# Altium project Controller.PrjPcb
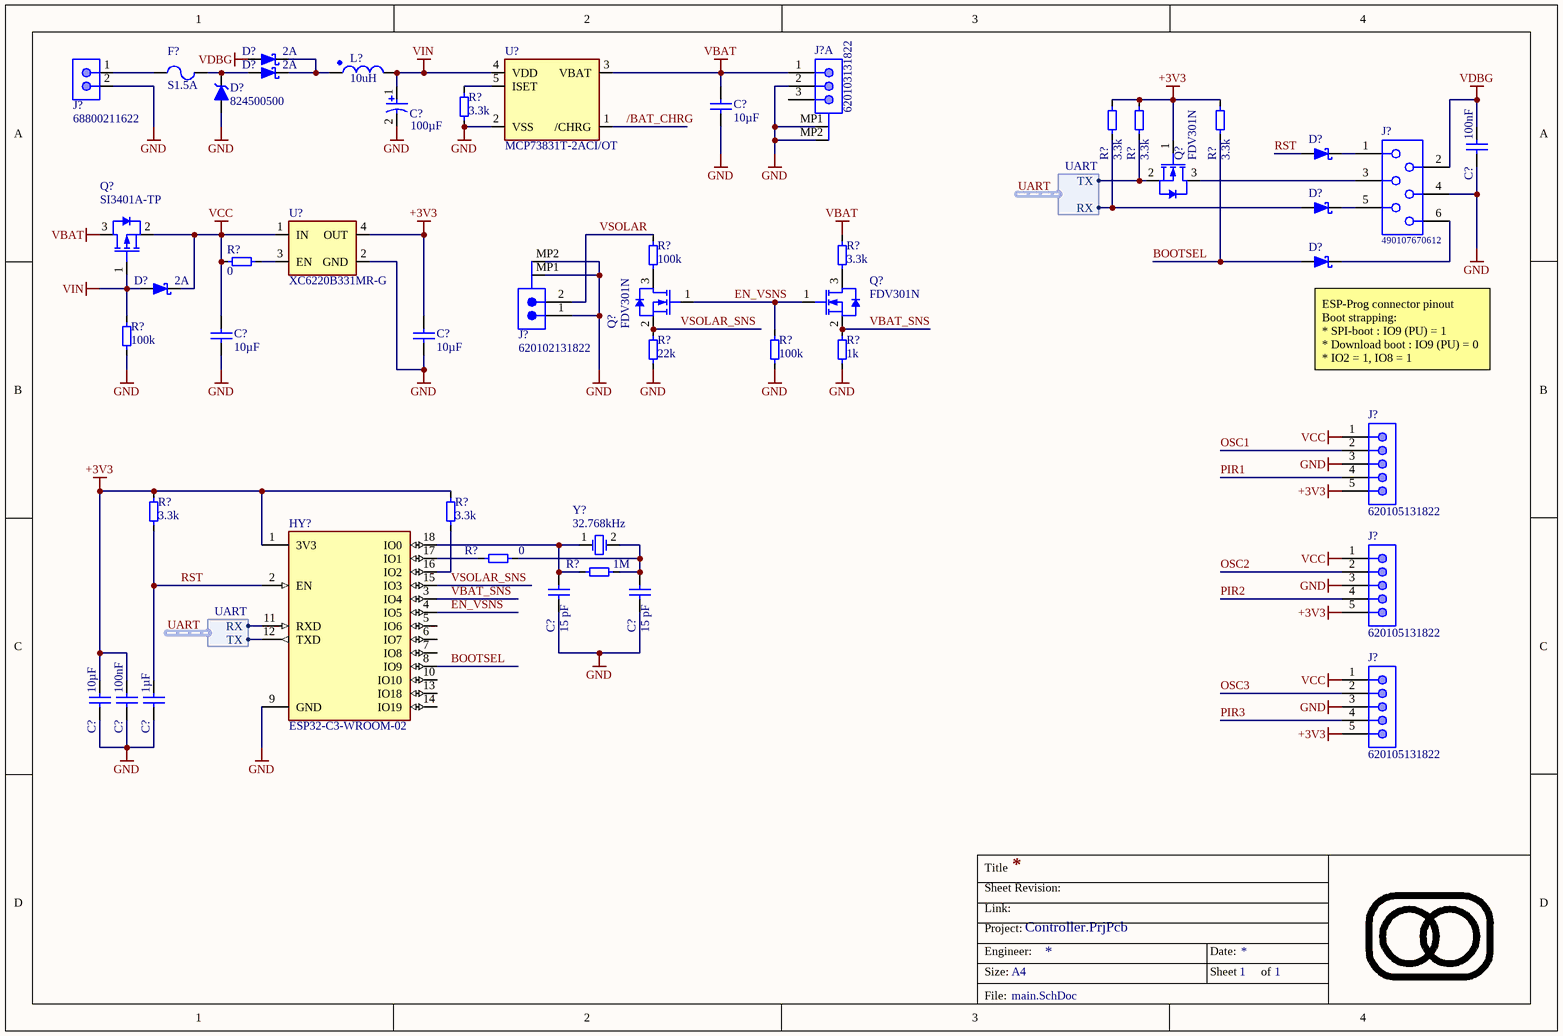
[diagram p0: main.SchDoc]
assembly_revision: 0; board_name: BRD123456; board_revision: 1.0
1 sheet, 50 parts. Net scope: global (net labels, ports and power ports of the same name join across sheets).
Board file: PCB.PcbDoc

## Sheet main.SchDoc
size A4; SheetNumber: 1; SheetTotal: 1

### Parts
(Parts that share a designator on the sheet are numbered #1, #2 ... from top to bottom, then left to right.)
C?#1  Capacitance: 100µF  [CA_POL_D5_H5.5]  (hidden comment: 875105242010)
C?#2  value 10µF  [0805-C-L]  (hidden comment: Capacitor 10µF +/-10% 10V X7R 0805)
C?#3  value 100nF  [0603-C-L]  (hidden comment: Capacitor 100nF +/-10% 25V X7R 0603)
C?#4  value 10µF  [0805-C-L]  (hidden comment: Capacitor 10µF +/-10% 10V X7R 0805)
C?#5  value 10µF  [0805-C-L]  (hidden comment: Capacitor 10µF +/-10% 10V X7R 0805)
C?#6  value 15 pF  [0603-C-N]  (hidden comment: Capacitor 15 pF +/-5% 50V C0G 0603)
C?#7  value 15 pF  [0603-C-N]  (hidden comment: Capacitor 15 pF +/-5% 50V C0G 0603)
C?#8  value 10µF  [0805-C-L]  (hidden comment: Capacitor 10µF +/-10% 10V X7R 0805)
C?#9  value 100nF  [0603-C-L]  (hidden comment: Capacitor 100nF +/-10% 25V X7R 0603)
C?#10  value 1µF  [0603-C-N]  (hidden comment: Capacitor 1µF +/-10% 16V X7R 0603)
D?#1  Average Rectified Current: 2A  [FP-SOD123W-MFG]  (hidden comment: PMEG10020ELRX)
D?#2  Average Rectified Current: 2A  [FP-SOD123W-MFG]  (hidden comment: PMEG10020ELRX)
D?#3  824500500  [DO-214AC_UNI]
D?#4  1PS79SB30,115  [FP-SOD523-MFG]  (value not drawn)
D?#5  1PS79SB30,115  [FP-SOD523-MFG]  (value not drawn)
D?#6  1PS79SB30,115  [FP-SOD523-MFG]  (value not drawn)
D?#7  Average Rectified Current: 2A  [FP-SOD123W-MFG]  (hidden comment: PMEG10020ELRX)
F?  value S1.5A  [1206-R-N]  (hidden comment: SF-1206S150-2)
HY?  ESP32-C3-WROOM-02  [ESP32­C3­WROOM­02]
J?#1  620103131822  [620103131822]  (part A of 2)
J?#2  68800211622  [68800211622]
J?#3  620103131822  [620103131822]  (value not drawn)  (part B of 2)
J?#4  490107670612  [490107670612_Debugging Application]  (no BOM)
J?#5  620102131822  [620102131822]
J?#6  620105131822  [620105131822]
J?#7  620105131822  [620105131822]
J?#8  620105131822  [620105131822]
L?  Inductance: 10uH  [WE-MAIA_4030]  (hidden comment: 78438357100)
Q?#1  FDV301N  [SOT-23-3-N]
Q?#2  SI3401A-TP  [SOT-23-3-N]
Q?#3  FDV301N  [SOT-23-3-N]
Q?#4  FDV301N  [SOT-23-3-N]
R?#1  value 3.3k  [0603-R-N]  (hidden comment: Resistor 3.3k +/-1% 50V 0603)
R?#2  value 3.3k  [0603-R-N]  (hidden comment: Resistor 3.3k +/-1% 50V 0603)
R?#3  value 3.3k  [0603-R-N]  (hidden comment: Resistor 3.3k +/-1% 50V 0603)
R?#4  value 3.3k  [0603-R-N]  (hidden comment: Resistor 3.3k +/-1% 50V 0603)
R?#5  value 100k  [0603-R-N]  (hidden comment: Resistor 100k +/-1% 50V 0603)
R?#6  value 3.3k  [0603-R-N]  (hidden comment: Resistor 3.3k +/-1% 50V 0603)
R?#7  value 0  [0603-R-N]  (hidden comment: Jumper 0R <50 mOhm 1A 0603)
R?#8  value 100k  [0603-R-N]  (hidden comment: Resistor 100k +/-1% 50V 0603)
R?#9  value 22k  [0603-R-N]  (hidden comment: Resistor 22k +/-1% 50V 0603)
R?#10  value 100k  [0603-R-N]  (hidden comment: Resistor 100k +/-1% 50V 0603)
R?#11  value 1k  [0603-R-N]  (hidden comment: Resistor 1k +/-1% 50V 0603)
R?#12  value 3.3k  [0603-R-N]  (hidden comment: Resistor 3.3k +/-1% 50V 0603)
R?#13  value 3.3k  [0603-R-N]  (hidden comment: Resistor 3.3k +/-1% 50V 0603)
R?#14  value 0  [0603-R-N]  (hidden comment: Jumper 0R <50 mOhm 1A 0603)
R?#15  value 1M  [0603-R-N]  (hidden comment: Resistor 1M +/-1% 50V 0603)
U?#1  MCP73831T-2ACI/OT  [SOT25-N]
U?#2  XC6220B331MR-G  [SOT25-N]
Y?  Frequency: 32.768kHz  [WE-XTAL_CFPX-217]  (hidden comment: 830009678)

### Harnesses
UART: RX, TX

### Nets
+3V3: C?#5.1 C?#8.2 C?#9.2 HY?.1(3V3) J?#6.5 J?#7.5 J?#8.5 Q?#1.1(G) R?#2.2 R?#3.2 R?#4.2 R?#12.2 R?#13.2 U?#2.4(OUT)
GND: C?#1.2 C?#2.2 C?#3.1 C?#4.2 C?#5.2 C?#6.1 C?#7.1 C?#8.1 C?#9.1 C?#10.1 D?#3.2(A) HY?.9(GND) J?#1.2 J?#2.2 J?#3.MP1 J?#3.MP2 J?#4.4 J?#5.1 J?#5.MP1 J?#5.MP2 J?#6.3 J?#7.3 J?#8.3 R?#1.2 R?#8.2 R?#9.1 R?#10.2 R?#11.1 U?#1.2(VSS) U?#2.2(GND)
VBAT: C?#2.1 J?#1.1 Q?#2.3(DRAIN) R?#6.1 U?#1.3(VBAT)
VCC: C?#4.1 D?#7.1(K) J?#6.1 J?#7.1 J?#8.1 Q?#2.2(SOURCE) R?#7.1 U?#2.1(IN)
VDBG: C?#3.2 D?#1.2(A) J?#4.2
VIN: C?#1.1 D?#7.2(A) L?.2 Q?#2.1(GATE) R?#8.1 U?#1.4(VDD)
/BAT_CHRG: U?#1.1(/CHRG)
BOOTSEL: D?#6.2(A) HY?.8(IO9) R?#4.1
EN_VSNS: HY?.4(IO5) Q?#3.1(G) Q?#4.1(G) R?#10.1
OSC1: J?#6.2
OSC2: J?#7.2
OSC3: J?#8.2
PIR1: J?#6.4
PIR2: J?#7.4
PIR3: J?#8.4
RST: C?#10.2 D?#4.2(A) HY?.2(EN) R?#12.1
UART.RX: D?#5.2(A) HY?.11(RXD) R?#2.1 ; harness UART.RX
UART.TX: HY?.12(TXD) Q?#1.2(S) R?#3.1 ; harness UART.TX
VBAT_SNS: HY?.3(IO4) Q?#4.2(S) R?#11.2
VSOLAR: J?#5.2 R?#5.1
VSOLAR_SNS: HY?.15(IO3) Q?#3.2(S) R?#9.2
NetC?#6_2: C?#6.2 HY?.18(IO0) R?#15.1 Y?.1(OSC1)
NetC?#7_2: C?#7.2 R?#14.2 R?#15.2 Y?.2(OSC2)
NetD?#1_1: D?#1.1(K) D?#2.1(K) L?.1
NetD?#2_2: D?#2.2(A) D?#3.1(K) F?.2
NetD?#4_1: D?#4.1(K) J?#4.1
NetD?#5_1: D?#5.1(K) J?#4.5
NetD?#6_1: D?#6.1(K) J?#4.6
NetF?_1: F?.1 J?#2.1
NetHY?_16: HY?.16(IO2) R?#13.1
NetHY?_17: HY?.17(IO1) R?#14.1
NetJ?#4_3: J?#4.3 Q?#1.3(D)
NetQ?#3_3: Q?#3.3(D) R?#5.2
NetQ?#4_3: Q?#4.3(D) R?#6.2
NetR?#1_1: R?#1.1 U?#1.5(ISET)
NetR?#7_2: R?#7.2 U?#2.3(EN)

Not connected (* = marked no-connect by the designer): HY? 5(IO6) 6(IO7) 7(IO8) 10(IO10) 13(IO18) 14(IO19); J?#1 3

### Notes on the sheet
- (near D?#6) ESP-Prog connector pinout
  Boot strapping:
  * SPI-boot : IO9 (PU) = 1
  * Download boot : IO9 (PU) = 0
  * IO2 = 1, IO8 = 1
- Title
- Sheet Revision:
- Link:
- Size:
- Project:
- Engineer:
- A4
- Date:
- Sheet
- of
- File:

### Library data of the parts
C?#1 = CMP-150-000020-2: WCAP-PSLP Aluminum Polymer Capacitor, V-Chip SMT, D5 x H5.5mm, 100µF, 10V; Manufacturer: Wurth Elektronik; ESR: 30mO; Dissipation Factor: 8%; Leakage Current: 300µA; Technical Reference: PSEC055101M010DVCTBB000; Ripple Current: 1970mA; Capacitance Tolerance: +/-20%; Endurance: 2000h; Mount: Surface Mount; ComponentLink2URL: https://www.we-online.com/redexpert/spec/875105242010?ad; Height: 5.5mm; Design Item ID: 875105242010; Diameter: 5mm; Manufacturer Part Number: 875105242010; Source: WCAP-PSLP.SchLib; Operating Temperature Min: -55°C; Pin Count: 2; Packaging: Tape and Reel; ComponentLink2Description: Datasheet Link; Component Type: Standard; Match Code: WCAP-PSLP; ComponentLink1Description: Website Link; Rated Voltage (DC): 10V; ComponentLink1URL: https://www.we-online.com/redexpert/article/875105242010?ad; Operating Temperature Max: 105°C; Category: Aluminum Polymer Capacitors
C?#2 C?#4 C?#5 C?#8 = CMP-072-000663-10: WCAP-CSGP Multilayer Ceramic Chip Capacitor, General Purpose, size 0805, X7R, 10µF, 10VDC; Technical Reference: X7R0805106K010DFCT10000; Tolerance: 10%; Capacitor Type: MLCC; Insulation Resistance: 0.01GO; Length: 2mm; ComponentLink2URL: https://www.we-online.com/redexpert/spec/885012207026?ad; Packaging: Tape and Reel; ComponentLink1Description: Website Link; Design Item ID: 885012207026; Source: WCAP-CSGP.SchLib; ComponentLink2Description: Datasheet Link; Pins: 2; Usage: General Purpose; Voltage Rating: 10V; Height: 1.25mm; ComponentLink1URL: https://www.we-online.com/redexpert/article/885012207026?ad; Dielectric: X7R; Mounting Technology: SMT; Dissipation Factor: 10%; Min Operating Temperature: -55°C; Width: 1.25mm; Max Operating Temperature: 125°C; Case/Package: 0805; Match Code: WCAP-CSGP; JLCPCB Part #: C15850
C?#3 C?#9 = CMP-072-000593-10: WCAP-CSGP Multilayer Ceramic Chip Capacitor, General Purpose, size 0603, X7R, 100nF, 25VDC; Capacitor Type: MLCC; Tolerance: 10%; Dissipation Factor: 3.5%; Technical Reference: X7R0603104K025DFCT20000; Insulation Resistance: 5GO; Length: 1.6mm; Dielectric: X7R; Height: 0.8mm; Pins: 2; Min Operating Temperature: -55°C; Usage: General Purpose; Mounting Technology: SMT; Case/Package: 0603; Width: 0.8mm; Max Operating Temperature: 125°C; Voltage Rating: 25V; Design Item ID: 885012206071R; ComponentLink1URL: https://www.we-online.com/redexpert/article/885012206071R?ad; ComponentLink2URL: https://www.we-online.com/redexpert/spec/885012206071R?ad; Packaging: Tape and Reel; ComponentLink1Description: Website Link; Match Code: WCAP-CSGP; ComponentLink2Description: Datasheet Link; Source: WCAP-CSGP.SchLib
C?#6 C?#7 = CMP-001-00107-9: Capacitor MLCC, General Purpose, size 0603, C0G, 15 pF, +/-5%, 50V; Tolerance: 5%; Min Operating Temperature: -55°C; RoHS Compliant: Yes; Dielectric: C0G; Width: 0.8mm; Voltage Rating: 50V; Pins: 2; Height: 0.8mm; Max Operating Temperature: 125°C; Usage: General Purpose; Case/Package: 0603; Mounting Technology: SMT; Capacitor Type: MLCC; Length: 1.6mm
C?#10 = CMP-001-00004-18: Capacitor MLCC, General Purpose, size 0603, X7R, 1µF, +/-10%, 16V; Tolerance: 10%; Usage: General Purpose; Mounting Technology: SMT; Width: 0.8mm; Voltage Rating: 16V; RoHS Compliant: True; Capacitor Type: MLCC; Case/Package: 0603; Min Operating Temperature: -55°C; Dielectric: X7R; Pins: 2; Max Operating Temperature: 125°C; Length: 1.6mm; Height: 0.8mm; JLCPCB Part #: C15849
D?#1 D?#2 D?#7 = CMP-004-00046-6: Diode Schottky 100V 2A 2-Pin SOD-123F T/R; Forward Voltage: 830 mV @ 2 A; RoHS Compliant: Yes; Max Reverse Voltage (DC): 100V; Series: -; JLCPCB Part #: C456130; Forward Current: 2A; Mounting Technology: Surface Mount; Packaging: Tape and Reel; Case/Package: SOD-123F
D?#3 = CMP-074-000038-8: WE-TVSP SMT Power TVS Diode, DO-214AC, 400W, 5VDC, Unidirectional; Manufacturer: Wurth Elektronik; Clamping Voltage: 9.2V; (Reverse) Peak Pulse Current: 43.5A; (Reverse) Breakdown Voltage: 6.7V; DC Operating Voltage: 5V; Pin Count: 2; Component Type: Standard; Published Date: July 2020; Source: WE-TVSP_DO-214AC_Unidirectional.SchLib; JLCPCB Part #: C2925443; Mounting Technology: SMT; ComponentLink1URL: http://www.we-online.de; Polarity: Unidirectional; Power Dissipation: 400W; ComponentLink2URL: https://www.we-online.com/catalog/datasheet/824500500.pdf; Design Item ID: 824500500; ComponentLink2Description: Datasheet; Operating Temperature: -65 to +150degC; Packaging: Tape and Reel; Manufacturer Part Number: 824500500; Size: DO-214AC; ComponentLink1Description: Manufacturer
D?#4-D?#6 = CMP-004-00048-8: VR=40V IF=200mA 20pF; Forward Voltage: 600 mV @ 200 mA; Forward Current: 200mA; Max Repetitive Reverse Voltage (Vrrm): 40V; Case/Package: SOD-523; JLCPCB Part #: C426690; RoHS Compliant: Yes
F? = CMP-005-00019-2: Fuse Chip Slow Blow Acting 1.5A 63V SMD Solder Pad 1206 T/R UL; Fuse Type: Board Mount (Cartridge Style Excluded); DC Cold Resistance: 51mR; Fuse Size: 3.1 X 1.55 X 0.6mm; Body Material: Ceramic; Length: 3.1mm; Voltage Rating: 63V; Pins: 2; JLCPCB Part #: C913209; Packaging: Tape and Reel; Reach SVHC Compliant: No; Max Operating Temperature: 105°C; Mounting Technology: Surface Mount; Housing Material: Ceramic; Approvals: UL; Case/Package: 1206; Voltage Rating (DC): 63V; Width: 1.55mm; Fuse Current: 1.5A; Max Voltage Rating (DC): 63V; Case Code (Metric): 3216; RoHS Compliant: Yes; Series: SF-1206S; Termination: SMD/SMT; Case Code (Imperial): 1206; Current Rating: 1.5A; Depth: 1.55mm; Min Operating Temperature: -20°C; Radiation Hardening: No; Height: 0.6mm; Package Quantity: 10000; Terminal Material: Copper
HY? = CMP-019-000004-8: Module with 4 MB flash and on­board PCB antenna / Built around RISC­V single­core SoC / Supporting 2.4 GHz Wi­Fi and Bluetooth 5; pin to pad: 9>0+9; Design Item ID: ESP32-C3-WROOM-02; Source: 7c7_Modules.SchLib; Component Type: Standard; Pin Count: 19
J?#1 J?#3 = CMP-047-000041-7: WR-WTB SMT Male Horizontal Shrouded Header, pitch 2mm, 3p; Withstanding Voltage: 800VAC; Pin Number: 3; Contact Resistance: 20mOhm; Working Voltage: 100VAC; Rated Current: 2A; Design Item ID: 620103131822; Operating Temperature: -25 to +85degC; Pin Count: 3; Packaging: Tape and Reel; Published Date: January 2020; ComponentLink2URL: https://www.we-online.com/catalog/datasheet/620103131822.pdf; ComponentLink2Description: Datasheet; Mounting Technology: SMT; Type: Horizontal; Publisher: Wurth Elektronik; Pitch: 2mm; Component Type: Standard; Source: WR-WTB_2.00mm.SchLib; Gender: Male; Part Number: 620103131822
J?#2 = CMP-047-000210-5: WR-WTB “J” Type THT Vertical Male Shrouded Header, pitch 2.5mm, 2p; Pin Number: 2; Contact Resistance: 20mOhm; Working Voltage: 250VAC; Withstanding Voltage: 800VAC; Rated Current: 3A; Operating Temperature: -25 to +85degC; ComponentLink1URL: http://www.we-online.de; Source: WR-WTB_2.50mm.SchLib; Pin Count: 2; Type: Vertical; Published Date: January 2020; Packaging: Bag; ComponentLink2URL: https://www.we-online.com/catalog/datasheet/68800211622.pdf; ComponentLink2Description: Datasheet; Gender: Male; Mounting Technology: THT; Publisher: Wurth Elektronik; Design Item ID: 68800211622; JLCPCB Part #: C160262; Component Type: Standard; Part Number: 68800211622; ComponentLink1Description: Manufacturer; Pitch: 2.5mm
J?#4 = CMP-002-000028-7: WR-WST REDFIT IDC SKEDD, pitch 2.54mm, 6pins; Contact Resistance max.: 10mOhm; Gender: Transition; Rated Current: 1A; Pin Number: 6; Working Voltage: 100V(AC); Connector Type: Cable,IDC; Design Item ID: 490107670612; Source: WR-WST.SchLib; Packaging: Tube; ComponentLink2Description: Datasheet; Part Number: 490107670612; ComponentLink1Description: Manufacturer; Operating Temperature: -25 to +105degC; Pitch: 2.54mm; ComponentLink1URL: http://www.we-online.de; Published Date: November 2019; Mounting Technology: Press-In; Publisher: Wurth Elektronik; ComponentLink2URL: https://katalog.we-online.com/em/datasheet/490107670612.pdf; RoHS Compliant: Yes; Contact Plating: Gold; Series: REDFIT WR-WST
J?#5 = CMP-047-000040-12: WR-WTB SMT Male Horizontal Shrouded Header, pitch 2mm, 2p; Rated Current: 2A; Working Voltage: 100VAC; Contact Resistance: 20mOhm; Withstanding Voltage: 800VAC; Pin Number: 2; Part Number: 620102131822; Design Item ID: 620102131822; Source: WR-WTB_2.00mm.SchLib; ComponentLink2Description: Datasheet; JLCPCB Part #: C295747; Pitch: 2mm; ComponentLink1URL: http://www.we-online.de; Gender: Male; ComponentLink2URL: https://www.we-online.com/catalog/datasheet/620102131822.pdf; Operating Temperature: -25 to +85degC; Packaging: Tape and Reel; ComponentLink1Description: Manufacturer; Type: Horizontal; Published Date: January 2020; Publisher: Wurth Elektronik; Pin Count: 2; Component Type: Standard; Mounting Technology: SMT
J?#6-J?#8 = CMP-047-000043-5: WR-WTB SMT Male Horizontal Shrouded Header, pitch 2mm, 5p; Contact Resistance: 20mOhm; Rated Current: 2A; Pin Number: 5; Withstanding Voltage: 800VAC; Working Voltage: 100VAC; Published Date: January 2020; Type: Horizontal; JLCPCB Part #: C265104; Gender: Male; Component Type: Standard; Design Item ID: 620105131822; Mounting Technology: SMT; Source: WR-WTB_2.00mm.SchLib; ComponentLink2Description: Datasheet; Pitch: 2mm; Publisher: Wurth Elektronik; ComponentLink1Description: Manufacturer; Operating Temperature: -25 to +85degC; Pin Count: 5; Packaging: Tape and Reel; Part Number: 620105131822; ComponentLink1URL: http://www.we-online.de; ComponentLink2URL: https://www.we-online.com/catalog/datasheet/620105131822.pdf
L? = CMP-116-000112-5: WE-MAIA SMT Power Inductor, size 4030, 10uH, 3.05A, 110mOhm; Manufacturer: Wurth Elektronik; Saturation Current @ 10%: 3A; Case/Size Code: 4030; Saturation Current @ 30%: 5.95A; Self Resonant Frequency: 15MHz; Length: 4.1mm; ComponentLink1Description: Website Link; Mount: Surface Mount; ComponentLink2Description: Datasheet Link; Packaging: Tape and Reel; Height: 3.1mm; Manufacturer Part Number: 78438357100; Component Type: Standard; Automotive: Yes; JLCPCB Part #: C167879; ComponentLink2URL: https://www.we-online.com/redexpert/spec/78438357100?ad; Width: 4.1mm; Match Code: WE-MAIA; Category: Power Inductors; ComponentLink1URL: https://www.we-online.com/redexpert/article/78438357100?ad; Operating Temperature Min: -40°C; Operating Temperature Max: 125°C; Source: WE-MAIA.SchLib; Pin Count: 2; DC Resistance Max: 110mOhm; Rated Current: 3.05A; Design Item ID: 78438357100
Q?#1 Q?#3 Q?#4 = CMP-013-00055-7: Transistor MOSFET N-Ch. 25V 220mA 0, 35W 4Ohm SOT23; Number of Channels: 1; Rise Time: 6ns; Rds On Max: 4R; Vgs (Max): 8V; Max Power Dissipation: 350mW; Input Capacitance: 9.5pF; Polarity: N-CHANNEL; Drain to Source Resistance: 5R; Vgs(th) (Max) @ Id: 1.06V @250µA; Transistor Type: NMOS; Turn-Off Delay Time: 3.5ns; Turn-On Delay Time: 3.2ns; Packaging: Tape and Reel; Series: -; Length: 2.9mm; Weight: 0.001093oz; Continuous Drain Current (ID): 220mA; Width: 1.3mm; Vds Max: 25V; Height: 1.2mm; Mounting Technology: Surface Mount; Gate to Source Voltage (Vgs): 8V; Min Operating Temperature: -55°C; Case/Package: SOT-23-3; Fall Time: 6ns; Id - Continuous Drain Current: 220mA; Pins: 3; Drain to Source Voltage (Vdss): 25V; Max Operating Temperature: 150°C; Package Quantity: 3000; JLCPCB Part #: C15310
Q?#2 = CMP-013-00056-5: Trans Mosfet P-ch 30V 4.2A 3-PIN SOT-23 T/r; Vgs(th) (Max) @ Id: -1.3V @ 250µA; Input Capacitance: 1.05nF; Rds On Max: 60mR; Max Power Dissipation: 400mW; Transistor Type: PMOS; Packaging: Cut Tape; RoHS Compliant: Yes; Vds Max: 30V; Id - Continuous Drain Current: 4.2A; Max Operating Temperature: 150°C; Series: -; Mounting Technology: Surface Mount; Case/Package: SOT-23-3; Min Operating Temperature: -55°C; JLCPCB Part #: C194253
R?#1-R?#4 R?#6 R?#12 R?#13 = CMP-009-00243-10: Chip Resistor, Thick Film, General Purpose, 0603, 100mW, 50V, 3.3 kOhm, +/-1%; Tolerance: 1%; Elements: 1; Power Rating: 100mW; Voltage Rating: 50V; RoHS Compliant: Yes; Usage: General Purpose; Max Operating Temperature: 155°C; Mounting Technology: SMT; Min Operating Temperature: -55°C; Case/Package: 0603; Pins: 2; Resistor Type: Thick Film; JLCPCB Part #: C22978
R?#5 R?#8 R?#10 = CMP-009-00023-20: Chip Resistor, Thick Film, General Purpose, 0603, 100mW, 50V, 100 kOhm, +/-1%; Elements: 1; Tolerance: 1%; JLCPCB Part #: C25803; Min Operating Temperature: -55°C; Usage: General Purpose; Resistor Type: Thick Film; Pins: 2; Mounting Technology: SMT; Case/Package: 0603; Max Operating Temperature: 155°C; RoHS Compliant: True; Voltage Rating: 50V; Power Rating: 100mW
R?#7 = CMP-009-00006-18: Chip Jumper, Thick Film, Jumper, 0603, 100mW, 1A, 0 Ohm, <50 mOhm; Elements: 1; Tolerance: 50 mOhm; Voltage Rating: 75V; Pins: 2; Usage: Jumper; Min Operating Temperature: -55°C; RoHS Compliant: True; JLCPCB Part #: C21189; Case/Package: 0603; Max Operating Temperature: 155°C; Resistor Type: Thick Film; Power Rating: 100mW; Mounting Technology: SMT; Current Rating: 1A
R?#9 = CMP-009-00245-15: Chip Resistor, Thick Film, General Purpose, 0603, 100mW, 50V, 22 kOhm, +/-1%; Tolerance: 1%; Elements: 1; RoHS Compliant: Yes; Power Rating: 100mW; Max Operating Temperature: 155°C; Usage: General Purpose; Min Operating Temperature: -55°C; Mounting Technology: SMT; Case/Package: 0603; JLCPCB Part #: C31850; Resistor Type: Thick Film; Pins: 2; Voltage Rating: 50V
R?#11 = CMP-009-00014-26: Chip Resistor, Thick Film, General Purpose, 0603, 100mW, 50V, 1 kOhm, +/-1%; FLIR Part #: YRES1K-1; Tolerance: 1%; Elements: 1; Resistor Type: Thick Film; Pins: 2; Voltage Rating: 50V; JLCPCB Part #: C21190; Power Rating: 100mW; Max Operating Temperature: 155°C; RoHS Compliant: Yes; Min Operating Temperature: -55°C; Usage: General Purpose; Mounting Technology: SMT; Case/Package: 0603
R?#14 = CMP-009-00006-23: Chip Jumper, Thick Film, Jumper, 0603, 100mW, 1A, 0 Ohm, <50 mOhm; FLIR Part #: YRES0E-1; Tolerance: 50 mOhm; Voltage Rating: 75V; Elements: 1; Usage: Jumper; Case/Package: 0603; Power Rating: 100mW; Current Rating: 1A; Min Operating Temperature: -55°C; RoHS Compliant: True; Resistor Type: Thick Film; Max Operating Temperature: 155°C; JLCPCB Part #: C21189; Pins: 2; Mounting Technology: SMT
R?#15 = CMP-009-00234-15: Chip Resistor, Thick Film, General Purpose, 0603, 100mW, 50V, 1 MOhm, +/-1%; Elements: 1; Tolerance: 1%; Case/Package: 0603; Min Operating Temperature: -55°C; Max Operating Temperature: 155°C; Pins: 2; Usage: General Purpose; Mounting Technology: SMT; JLCPCB Part #: C22935; Resistor Type: Thick Film; Voltage Rating: 50V; Power Rating: 100mW; RoHS Compliant: Yes
U?#1 = CMP-000031-6: IC CONTROLLR LI-ION 4.2V SOT23-5; Output Current: 500mA; Voltage Rating: 4.534V; Number of Channels: 1; Drain to Source Resistance: 350mR; Min Output Voltage: 4.168V; Fault Protection: Over Voltage; Max Power Dissipation: 1.54W; Min Supply Voltage: 3.75V; Max Output Voltage: 4.5V; Max Supply Voltage: 6V; Radiation Hardening: No; Width: 1.8mm; Length: 3.1mm; JLCPCB Part #: C424093; Case/Package: SOT-23; Output Voltage: 4.2V; Termination: SMD/SMT; Max Operating Temperature: 85°C; Battery Pack Voltage: 4.2V; Pins: 5; Height: 1.3mm; Lead Free: Lead Free; Weight: 0.00709oz; Packaging: Tape and Reel; Reach SVHC Compliant: Yes; Min Operating Temperature: -40°C; Max Charge Current: 500mA; Series: -; Contact Plating: Tin,Matte; Number of Cells: 1; Number of Outputs: 1; Mounting Technology: Surface Mount; RoHS Compliant: Yes
U?#2 = CMP-019-00081-3: Linear Voltage Regulator IC Positive Fixed 1 Output 1A SOT-25-5; pin to pad: 4>5; Output Voltage: 3.3V; Max Input Voltage: 6V; Min Input Voltage: 4V; Output Current: 1A; Case/Package: SOT-23-5
Y? = CMP-030-000070-2: WE-XTAL Watch Crystal, SMT, CFPX-217, 32.768kHz, +/-20ppm; Manufacturer: Wurth Elektronik; Load Capacitance: 12.5pF; Manufacturer Part Number: 830009678; ComponentLink1Description: Manufacturer; Size: CFPX-217; Mounting Technology: SMT; Packaging: Tape and Reel; ComponentLink2URL: https://katalog.we-online.com/pbs/datasheet/830009678.pdf; Frequency Tolerance: +/-20ppm; Operating Temperature: -40 to +85degC; Component Type: Standard; Frequency Stability: -; Design Item ID: 830009678; Pin Count: 2; ComponentLink1URL: http://www.we-online.de; Published Date: July 2020; Source: WE-XTAL_CFPX-217.SchLib; ComponentLink2Description: Datasheet

## Assembly variants
A: all parts fitted